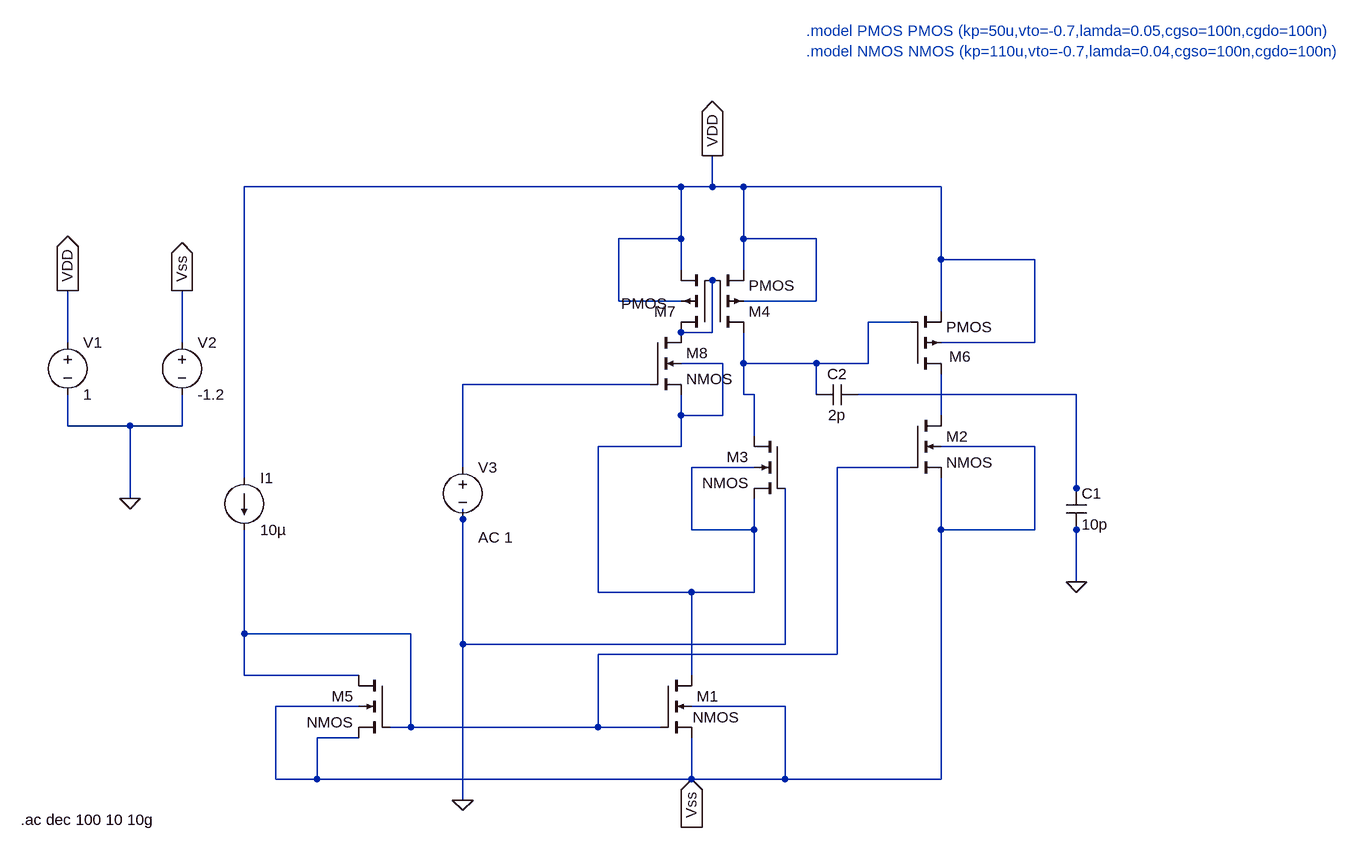
[diagram p0: schematic GREAT.asc]
GREAT.asc, the LTspice schematic file:
Version 4
SHEET 1 1160 680
WIRE 64 -432 -608 -432
WIRE 112 -432 112 -480
WIRE 112 -432 64 -432
WIRE 160 -432 112 -432
WIRE 464 -432 160 -432
WIRE 64 -352 64 -432
WIRE 64 -352 -32 -352
WIRE 160 -352 160 -432
WIRE 272 -352 160 -352
WIRE 464 -320 464 -432
WIRE 608 -320 464 -320
WIRE 64 -304 64 -352
WIRE 160 -304 160 -352
WIRE -32 -256 -32 -352
WIRE 64 -256 -32 -256
WIRE 272 -256 272 -352
WIRE 272 -256 160 -256
WIRE 464 -240 464 -320
WIRE 416 -224 352 -224
WIRE 112 -208 112 -288
WIRE 112 -208 64 -208
WIRE -880 -192 -880 -272
WIRE -704 -192 -704 -272
WIRE 608 -192 608 -320
WIRE 608 -192 464 -192
WIRE 128 -160 64 -160
WIRE 160 -160 160 -208
WIRE 272 -160 160 -160
WIRE 352 -160 352 -224
WIRE 352 -160 272 -160
WIRE 16 -128 -272 -128
WIRE 160 -112 160 -160
WIRE 176 -112 160 -112
WIRE 272 -112 272 -160
WIRE 672 -112 336 -112
WIRE 64 -80 64 -112
WIRE 128 -80 128 -160
WIRE 128 -80 64 -80
WIRE 464 -80 464 -144
WIRE -880 -64 -880 -112
WIRE -784 -64 -880 -64
WIRE -704 -64 -704 -112
WIRE -704 -64 -784 -64
WIRE 176 -48 176 -112
WIRE 64 -32 64 -80
WIRE 64 -32 -64 -32
WIRE 608 -32 464 -32
WIRE -272 0 -272 -128
WIRE 176 0 80 0
WIRE 416 0 304 0
WIRE -608 16 -608 -432
WIRE 672 32 672 -112
WIRE -784 48 -784 -64
WIRE 672 48 672 32
WIRE -272 80 -272 64
WIRE 80 96 80 0
WIRE 176 96 176 48
WIRE 176 96 80 96
WIRE 464 96 464 16
WIRE 608 96 608 -32
WIRE 608 96 464 96
WIRE 672 96 672 80
WIRE 672 176 672 96
WIRE -64 192 -64 -32
WIRE 80 192 -64 192
WIRE 176 192 176 96
WIRE 176 192 80 192
WIRE -608 256 -608 96
WIRE -352 256 -608 256
WIRE -272 272 -272 80
WIRE 224 272 224 32
WIRE 224 272 -272 272
WIRE 304 288 304 0
WIRE 304 288 -64 288
WIRE -608 320 -608 256
WIRE -432 320 -608 320
WIRE 80 320 80 192
WIRE -432 368 -560 368
WIRE 224 368 80 368
WIRE -352 400 -352 256
WIRE -352 400 -384 400
WIRE -64 400 -64 288
WIRE -64 400 -352 400
WIRE 32 400 -64 400
WIRE -432 416 -496 416
WIRE -560 480 -560 368
WIRE -496 480 -496 416
WIRE -496 480 -560 480
WIRE 80 480 80 416
WIRE 80 480 -496 480
WIRE 224 480 224 368
WIRE 224 480 80 480
WIRE 464 480 464 96
WIRE 464 480 224 480
WIRE -272 512 -272 272
FLAG 672 176 0
FLAG -272 512 0
FLAG 112 -480 VDD
IOPIN 112 -480 Out
FLAG 80 480 Vss
IOPIN 80 480 In
FLAG -880 -272 VDD
IOPIN -880 -272 Out
FLAG -704 -272 Vss
IOPIN -704 -272 Out
FLAG -784 48 0
SYMBOL nmos4 32 320 R0
WINDOW 3 50 65 Left 2
SYMATTR InstName M1
SYMBOL nmos4 416 -80 R0
SYMATTR InstName M2
SYMBOL nmos4 224 -48 M0
SYMATTR InstName M3
SYMBOL pmos4 112 -208 M180
SYMATTR InstName M4
SYMBOL pmos4 416 -144 M180
WINDOW 0 60 27 Left 2
SYMATTR InstName M6
SYMBOL cap 336 -128 R90
WINDOW 0 0 32 VBottom 2
WINDOW 3 32 32 VTop 2
SYMATTR InstName C2
SYMATTR Value 2p
SYMBOL pmos4 112 -208 R180
WINDOW 3 70 44 Left 2
SYMATTR InstName M7
SYMBOL voltage -880 -208 R0
SYMATTR InstName V1
SYMATTR Value 1
SYMBOL voltage -704 -208 R0
WINDOW 123 0 0 Left 0
WINDOW 39 0 0 Left 0
SYMATTR InstName V2
SYMATTR Value -1.2
SYMBOL cap 656 32 R0
SYMATTR InstName C1
SYMATTR Value 10p
SYMBOL nmos4 16 -208 R0
SYMATTR InstName M8
SYMBOL nmos4 -384 320 M0
SYMATTR InstName M5
SYMBOL voltage -272 -16 R0
WINDOW 123 24 124 Left 2
WINDOW 39 0 0 Left 0
SYMATTR InstName V3
SYMATTR Value ""
SYMATTR Value2 AC 1
SYMBOL current -608 16 R0
WINDOW 123 0 0 Left 0
WINDOW 39 0 0 Left 0
SYMATTR InstName I1
SYMATTR Value 10µ
TEXT 256 -672 Left 2 ;.model PMOS PMOS (kp=50u,vto=-0.7,lamda=0.05,cgso=100n,cgdo=100n)\n.model NMOS NMOS (kp=110u,vto=-0.7,lamda=0.04,cgso=100n,cgdo=100n)
TEXT -952 542 Left 2 !.ac dec 100 10 10g

The netlist it stands for:
* GREAT.asc
M1 N003 N007 Vss Vss NMOS
M2 N006 N007 Vss Vss NMOS
M3 N001 0 N003 N003 NMOS
M4 N001 N002 VDD VDD PMOS
M6 N006 N001 VDD VDD PMOS
C2 N005 N001 2p
M7 N002 N002 VDD VDD PMOS
V1 VDD 0 1
V2 Vss 0 -1.2
C1 N005 0 10p
M8 N002 N004 N003 N003 NMOS
M5 N007 N007 Vss Vss NMOS
V3 N004 0 AC 1
I1 VDD N007 10µ
.model NMOS NMOS
.model PMOS PMOS
.lib standard.mos
* .model PMOS PMOS (kp=50u,vto=-0.7,lamda=0.05,cgso=100n,cgdo=100n)
* .model NMOS NMOS (kp=110u,vto=-0.7,lamda=0.04,cgso=100n,cgdo=100n)
.ac dec 100 10 10g
.backanno
.end